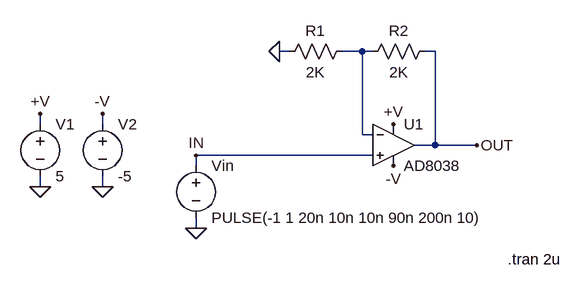
[diagram p0: schematic AD8038.asc]
AD8038.asc, the LTspice schematic file:
Version 4
SHEET 1 1240 700
WIRE 400 -1248 384 -1248
WIRE 512 -1248 480 -1248
WIRE 528 -1248 512 -1248
WIRE 624 -1248 608 -1248
WIRE 16 -1136 16 -1152
WIRE 112 -1136 112 -1152
WIRE 512 -1120 512 -1248
WIRE 528 -1120 512 -1120
WIRE 624 -1104 624 -1248
WIRE 624 -1104 592 -1104
WIRE 688 -1104 624 -1104
WIRE 528 -1088 256 -1088
WIRE 256 -1072 256 -1088
WIRE 16 -1040 16 -1056
WIRE 112 -1040 112 -1056
WIRE 256 -976 256 -992
FLAG 256 -976 0
FLAG 688 -1104 OUT
FLAG 256 -1088 IN
FLAG 560 -1136 +V
FLAG 560 -1072 -V
FLAG 384 -1248 0
FLAG 16 -1152 +V
FLAG 16 -1040 0
FLAG 112 -1152 -V
FLAG 112 -1040 0
SYMBOL voltage 256 -1088 R0
WINDOW 123 24 146 Left 2
WINDOW 39 24 125 Left 2
SYMATTR InstName Vin
SYMATTR Value PULSE(-1 1 20n 10n 10n 90n 200n 10)
SYMBOL res 496 -1264 R90
WINDOW 0 0 56 VBottom 2
WINDOW 3 32 56 VTop 2
SYMATTR InstName R1
SYMATTR Value 2K
SYMBOL res 624 -1264 R90
WINDOW 0 0 56 VBottom 2
WINDOW 3 32 56 VTop 2
SYMATTR InstName R2
SYMATTR Value 2K
SYMBOL Opamps\\AD8038 560 -1168 R0
SYMATTR InstName U1
SYMBOL voltage 16 -1152 R0
WINDOW 123 0 0 Left 2
WINDOW 39 0 0 Left 2
SYMATTR InstName V1
SYMATTR Value 5
SYMBOL voltage 112 -1152 R0
WINDOW 123 24 146 Left 2
WINDOW 39 24 125 Left 2
SYMATTR InstName V2
SYMATTR Value -5
TEXT 736 -928 Left 2 !.tran 2u

The netlist it stands for:
* AD8038.asc
Vin IN 0 PULSE(-1 1 20n 10n 10n 90n 200n 10)
R1 N001 0 2K
R2 OUT N001 2K
XU1 IN N001 +V -V OUT AD8038  ; pins In+ In- V+ V- OUT
V1 +V 0 5
V2 -V 0 -5
.tran 2u
.backanno
.end